# EAGLE schematic PiezoAmpBoard (EAGLE 8.0.2)
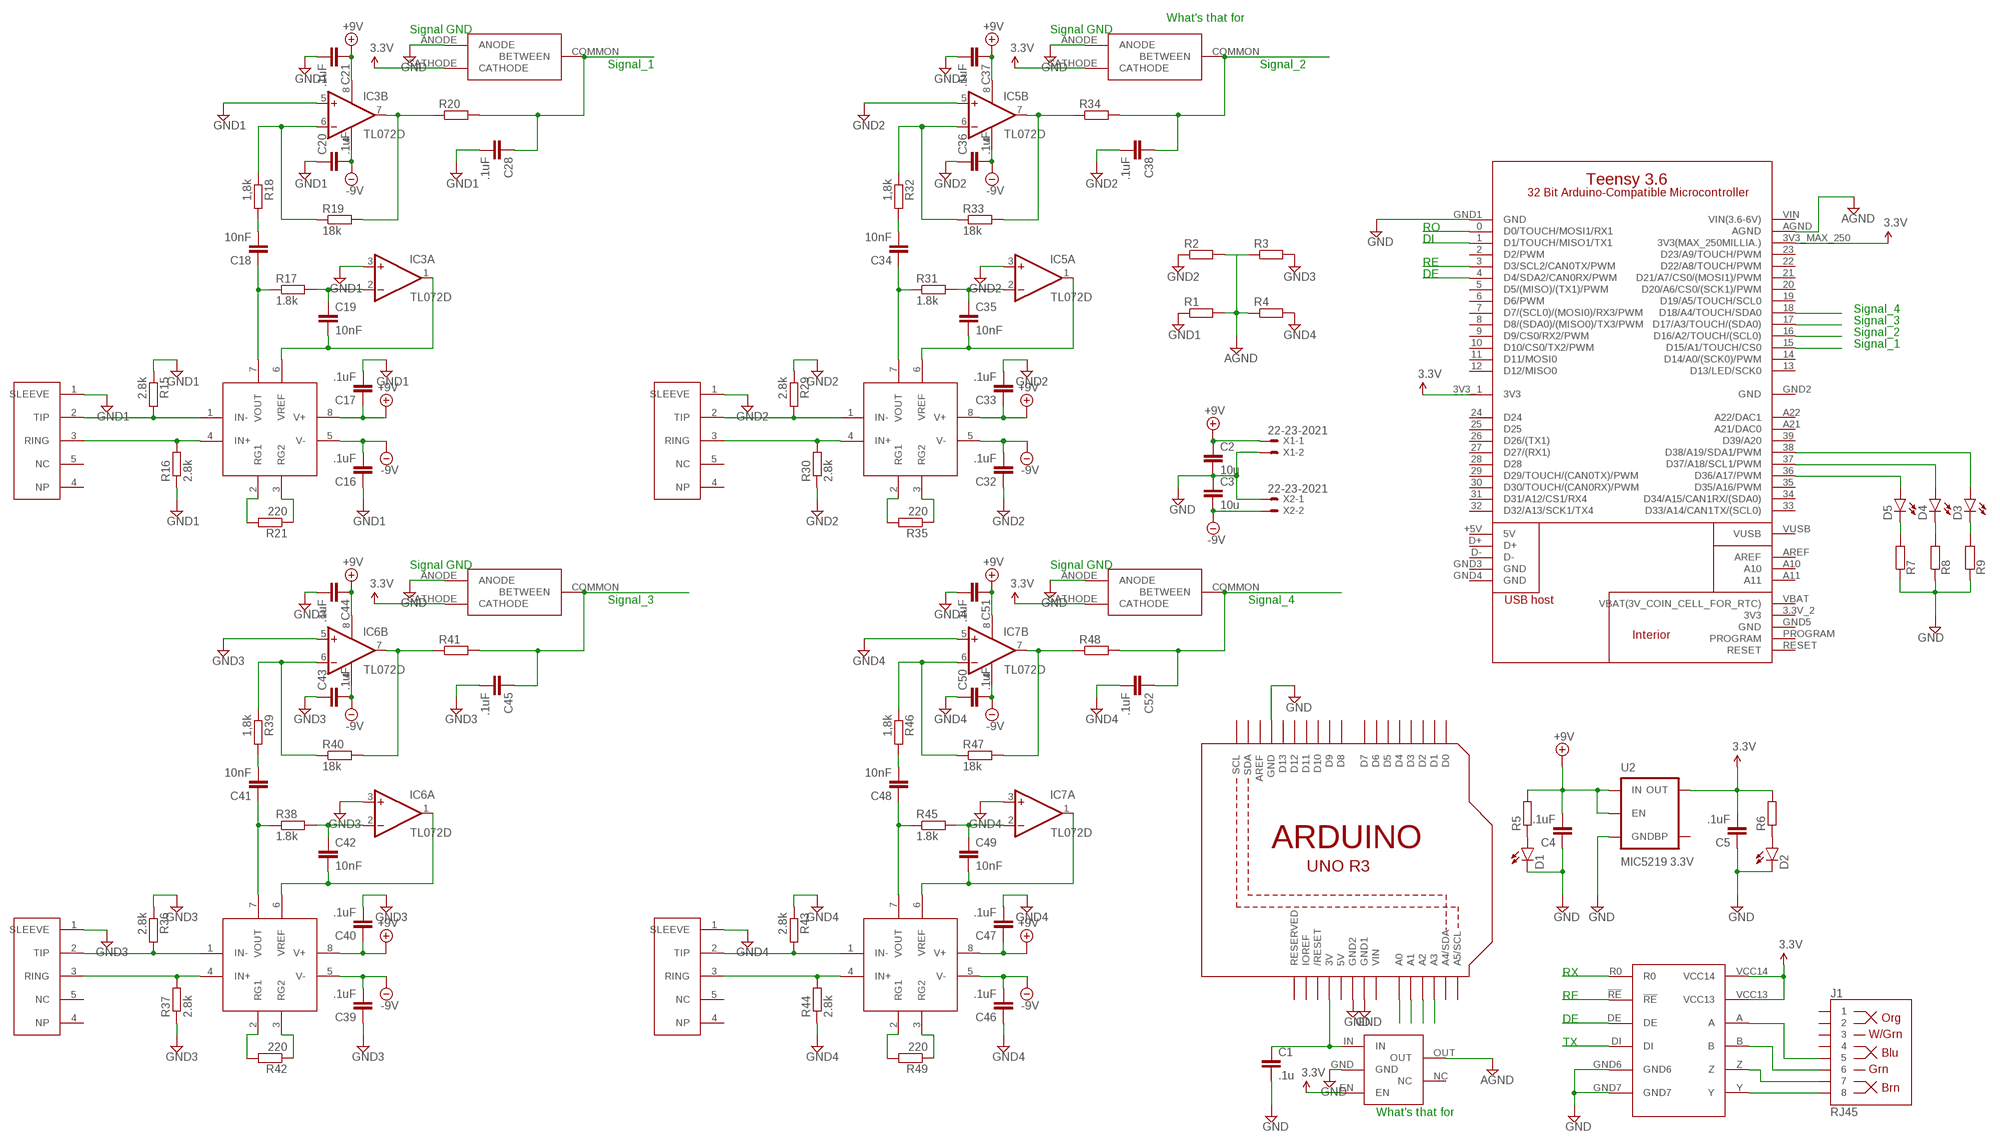
[diagram p0: schematic, sheet 1]

## Parts
C1  .1u  C-EUC0603  [C0603]
C2  10u  C-EUC0603  [C0603]
C3  10u  C-EUC0603  [C0603]
C4  .1uF  CC0603  [C0603]
C5  .1uF  CC0603  [C0603]
C16  .1uF  CC0603  [C0603]
C17  .1uF  CC0603  [C0603]
C18  10nF  CC0603  [C0603]
C19  10nF  CC0603  [C0603]
C20  .1uF  CC0603  [C0603]
C21  .1uF  CC0603  [C0603]
C28  .1uF  CC0603  [C0603]
C32  .1uF  CC0603  [C0603]
C33  .1uF  CC0603  [C0603]
C34  10nF  CC0603  [C0603]
C35  10nF  CC0603  [C0603]
C36  .1uF  CC0603  [C0603]
C37  .1uF  CC0603  [C0603]
C38  .1uF  CC0603  [C0603]
C39  .1uF  CC0603  [C0603]
C40  .1uF  CC0603  [C0603]
C41  10nF  CC0603  [C0603]
C42  10nF  CC0603  [C0603]
C43  .1uF  CC0603  [C0603]
C44  .1uF  CC0603  [C0603]
C45  .1uF  CC0603  [C0603]
C46  .1uF  CC0603  [C0603]
C47  .1uF  CC0603  [C0603]
C48  10nF  CC0603  [C0603]
C49  10nF  CC0603  [C0603]
C50  .1uF  CC0603  [C0603]
C51  .1uF  CC0603  [C0603]
C52  .1uF  CC0603  [C0603]
D1  LED0603  [LED-0603]
D2  LED0603  [LED-0603]
D3  LED0603  [LED-0603]
D4  LED0603  [LED-0603]
D5  LED0603  [LED-0603]
IC3  TL072D  [SO08]
IC5  TL072D  [SO08]
IC6  TL072D  [SO08]
IC7  TL072D  [SO08]
J1  RJ45  RJ45-8  [RJ45-8]
R1  R-EU_R0603  [R0603]
R2  R-EU_R0603  [R0603]
R3  R-EU_R0603  [R0603]
R4  R-EU_R0603  [R0603]
R5  R-EU_R0603  [R0603]
R6  R-EU_R0603  [R0603]
R7  R-EU_R0603  [R0603]
R8  R-EU_R0603  [R0603]
R9  R-EU_R0603  [R0603]
R15  2.8k  R-EU_R0603  [R0603]
R16  2.8k  R-EU_R0603  [R0603]
R17  1.8k  R-EU_R0603  [R0603]
R18  1,8k  R-EU_R0603  [R0603]
R19  18k  R-EU_R0603  [R0603]
R20  R-EU_R0603  [R0603]
R21  220  R-EU_R0603  [R0603]
R29  2.8k  R-EU_R0603  [R0603]
R30  2.8k  R-EU_R0603  [R0603]
R31  1.8k  R-EU_R0603  [R0603]
R32  1,8k  R-EU_R0603  [R0603]
R33  18k  R-EU_R0603  [R0603]
R34  R-EU_R0603  [R0603]
R35  220  R-EU_R0603  [R0603]
R36  2.8k  R-EU_R0603  [R0603]
R37  2.8k  R-EU_R0603  [R0603]
R38  1.8k  R-EU_R0603  [R0603]
R39  1,8k  R-EU_R0603  [R0603]
R40  18k  R-EU_R0603  [R0603]
R41  R-EU_R0603  [R0603]
R42  220  R-EU_R0603  [R0603]
R43  2.8k  R-EU_R0603  [R0603]
R44  2.8k  R-EU_R0603  [R0603]
R45  1.8k  R-EU_R0603  [R0603]
R46  1,8k  R-EU_R0603  [R0603]
R47  18k  R-EU_R0603  [R0603]
R48  R-EU_R0603  [R0603]
R49  220  R-EU_R0603  [R0603]
U1  ARDUINOR3-BPLACE  [ARDUINOR3-BPLACE]
U2  MIC5219 3.3V  V_REG_MIC52193.3V  [SOT23-5]
U$1  TPS76316  [PDSO]
U$2  TEENSY-3.6_ONLY_HOLES  [TEENSY-3.6_ONLY_HOLES]
U$3  MAX3491  [MAX3491]
U$4  AD82216  [SOIC08]
U$6  BAV99T  [SOT-523]
U$11  3MMJACK  [1X05]
U$14  AD82216  [SOIC08]
U$15  BAV99T  [SOT-523]
U$16  3MMJACK  [1X05]
U$17  AD82216  [SOIC08]
U$18  BAV99T  [SOT-523]
U$19  3MMJACK  [1X05]
U$20  AD82216  [SOIC08]
U$21  BAV99T  [SOT-523]
U$22  3MMJACK  [1X05]
X1  22-23-2021  [22-23-2021]
X2  22-23-2021  [22-23-2021]

## Nets
3.3V: C1.1 C5.2 R6.2 U1.3V U2.5(OUT) U$1.EN U$1.IN U$2.3V3_1(3V3) U$2.3V3_MAX_250(3V3(MAX_250MILLIA.)) U$3.VCC13 U$3.VCC14 U$6.CATHODE U$15.CATHODE U$18.CATHODE U$21.CATHODE
+9V: C4.2 R5.2 U2.1(IN) U2.3(EN)
AGND: R1.2 R2.2 R3.1 R4.1 U$1.OUT U$2.AGND
DE: U$3.DE
GND: C1.2 C2.2 C3.1 C4.1 C5.1 D1.C D2.C R7.1 R8.1 R9.1 U1.GND U1.GND1 U1.GND2 U2.2(GND) U$1.GND U$2.GND1(GND) U$3.GND6 U$3.GND7 U$6.ANODE U$15.ANODE U$18.ANODE U$21.ANODE X1.2 X2.1
GND1: C16.1 C17.2 C20.1 C21.2 C28.2 IC3.3(A:+IN) IC3.5(B:+IN) R1.1 R15.1 R16.1 U$11.1(SLEEVE)
GND2: C32.1 C33.2 C36.1 C37.2 C38.2 IC5.3(A:+IN) IC5.5(B:+IN) R2.1 R29.1 R30.1 U$16.1(SLEEVE)
GND3: C39.1 C40.2 C43.1 C44.2 C45.2 IC6.3(A:+IN) IC6.5(B:+IN) R3.2 R36.1 R37.1 U$19.1(SLEEVE)
GND4: C46.1 C47.2 C50.1 C51.2 C52.2 IC7.3(A:+IN) IC7.5(B:+IN) R4.2 R43.1 R44.1 U$22.1(SLEEVE)
N$1: D1.A R5.1
N$2: D2.A R6.1
N$3: D3.A U$2.38(D38/A19/SDA1/PWM)
N$4: D4.A U$2.37(D37/A18/SCL1/PWM)
N$5: D5.A U$2.36(D36/A17/PWM)
N$6: D3.C R9.2
N$7: D4.C R8.2
N$8: D5.C R7.2
N$9: J1.8 U$3.Y
N$10: J1.7 U$3.Z
N$11: J1.6 U$3.B
N$12: J1.5 U$3.A
N$19: R15.2 U$4.1(IN-) U$11.2(TIP)
N$20: R16.2 U$4.4(IN+) U$11.3(RING)
N$21: R21.2 U$4.2(RG1)
N$22: R21.1 U$4.3(RG2)
N$23: C18.1 R17.1 U$4.7(VOUT)
N$24: C19.1 IC3.2(A:-IN) R17.2
N$25: IC3.7(B:OUT) R19.2 R20.1
N$26: C18.2 R18.2
N$27: IC3.6(B:-IN) R18.1 R19.1
N$37: R29.2 U$14.1(IN-) U$16.2(TIP)
N$39: R30.2 U$14.4(IN+) U$16.3(RING)
N$40: R35.2 U$14.2(RG1)
N$41: R35.1 U$14.3(RG2)
N$42: C34.1 R31.1 U$14.7(VOUT)
N$43: C35.1 IC5.2(A:-IN) R31.2
N$44: IC5.7(B:OUT) R33.2 R34.1
N$45: C34.2 R32.2
N$46: IC5.6(B:-IN) R32.1 R33.1
N$47: R36.2 U$17.1(IN-) U$19.2(TIP)
N$48: R37.2 U$17.4(IN+) U$19.3(RING)
N$49: R42.2 U$17.2(RG1)
N$50: R42.1 U$17.3(RG2)
N$51: C41.1 R38.1 U$17.7(VOUT)
N$52: C42.1 IC6.2(A:-IN) R38.2
N$53: IC6.7(B:OUT) R40.2 R41.1
N$54: C41.2 R39.2
N$55: IC6.6(B:-IN) R39.1 R40.1
N$56: R43.2 U$20.1(IN-) U$22.2(TIP)
N$57: R44.2 U$20.4(IN+) U$22.3(RING)
N$58: R49.2 U$20.2(RG1)
N$59: R49.1 U$20.3(RG2)
N$60: C48.1 R45.1 U$20.7(VOUT)
N$61: C49.1 IC7.2(A:-IN) R45.2
N$62: IC7.7(B:OUT) R47.2 R48.1
N$63: C48.2 R46.2
N$64: IC7.6(B:-IN) R46.1 R47.1
PEIZOIN1: C28.1 R20.2 U1.A0 U$2.15(D15/A1/TOUCH/CS0) U$6.COMMON(BETWEEN)
PEIZOIN2: C38.1 R34.2 U1.A1 U$2.16(D16/A2/TOUCH/(SCL0)) U$15.COMMON(BETWEEN)
PEIZOIN3: C45.1 R41.2 U1.A2 U$2.17(D17/A3/TOUCH/(SDA0)) U$18.COMMON(BETWEEN)
PEIZOIN4: C52.1 R48.2 U1.A3 U$2.18(D18/A4/TOUCH/SDA0) U$21.COMMON(BETWEEN)
RE: U$2.3(D3/SCL2/CAN0TX/PWM) U$2.4(D4/SDA2/CAN0RX/PWM) U$3.!RE
RX: U$2.0(D0/TOUCH/MOSI1/RX1) U$3.R0
TX: U$2.1(D1/TOUCH/MISO1/TX1) U$3.DI
VREF2: C19.2 IC3.1(A:OUT) U$4.6(VREF)
VREF4: C35.2 IC5.1(A:OUT) U$14.6(VREF)
VREF5: C42.2 IC6.1(A:OUT) U$17.6(VREF)
VREF6: C49.2 IC7.1(A:OUT) U$20.6(VREF)
VS+1: C2.1 C17.1 C21.1 C33.1 C37.1 C40.1 C44.1 C47.1 C51.1 IC3.8(P:V+) IC5.8(P:V+) IC6.8(P:V+) IC7.8(P:V+) U$4.8(V+) U$14.8(V+) U$17.8(V+) U$20.8(V+) X1.1 ; supply symbol labelled +9V
VS-: C3.2 C16.2 C20.2 C32.2 C36.2 C39.2 C43.2 C46.2 C50.2 IC3.4(P:V-) IC5.4(P:V-) IC6.4(P:V-) IC7.4(P:V-) U$4.5(V-) U$14.5(V-) U$17.5(V-) U$20.5(V-) X2.2 ; supply symbol labelled -9V
Unconnected: J1.1 J1.2 J1.3 J1.4 U1.A4(A4/SDA) U1.A5(A5/SCL) U1.AREF U1.D0 U1.D1 U1.D2 U1.D3 U1.D4 U1.D5 U1.D6 U1.D7 U1.D8 U1.D9 U1.D10 U1.D11 U1.D12 U1.D13 U1.IOREF U1.RESERVED U1.RESET(/RESET) U1.SCL U1.SDA U2.4(BP) U$1.NC U$2.2(D2/PWM) U$2.3.3V_2(3V3) U$2.5(D5/(MISO)/(TX1)/PWM) U$2.6(D6/PWM) U$2.7(D7/(SCL0)/(MOSI0)/RX3/PWM) U$2.8(D8/(SDA0)/(MISO0)/TX3/PWM) U$2.9(D9/CS0/RX2/PWM) U$2.10(D10/CS0/TX2/PWM) U$2.11(D11/MOSI0) U$2.12(D12/MISO0) U$2.13(D13/LED/SCK0) U$2.14(D14/A0/(SCK0)/PWM) U$2.19(D19/A5/TOUCH/SCL0) U$2.20(D20/A6/CS0/(SCK1)/PWM) U$2.21(D21/A7/CS0/(MOSI1)/PWM) U$2.22(D22/A8/TOUCH/PWM) U$2.23(D23/A9/TOUCH/PWM) U$2.24(D24) U$2.25(D25) U$2.26(D26/(TX1)) U$2.27(D27/(RX1)) U$2.28(D28) U$2.29(D29/TOUCH/(CAN0TX)/PWM) U$2.30(D30/TOUCH/(CAN0RX)/PWM) U$2.31(D31/A12/CS1/RX4) U$2.32(D32/A13/SCK1/TX4) U$2.33(D33/A14/CAN1TX/(SCL0)) U$2.34(D34/A15/CAN1RX/(SDA0)) U$2.35(D35/A16/PWM) U$2.39(D39/A20) U$2.+5V(5V) U$2.A10 U$2.A11 U$2.A21(A21/DAC0) U$2.A22(A22/DAC1) U$2.AREF U$2.D+ U$2.D- U$2.GND3(GND) U$2.GND4(GND) U$2.GND5(GND) U$2.PROGRAM U$2.RESET U$2.VBAT(VBAT(3V_COIN_CELL_FOR_RTC)) U$2.VUSB U$11.4(NP) U$11.5(NC) U$16.4(NP) U$16.5(NC) U$19.4(NP) U$19.5(NC) U$22.4(NP) U$22.5(NC)

## Notes on the sheet
- What's that for
- Signal GND | Signal GND
- Signal_1 | Signal_2
- RO
- DI
- RE
- DE
- Signal_4
- Signal_3
- Signal_2
- Signal_1
- Signal GND | Signal GND
- Signal_3 | Signal_4
- RX
- RE
- DE
- TX
- What's that for

## Power pins joined to a net without a drawn wire
5V: U1.5V
GND: U$2.GND2(GND)
VIN: U1.VIN
VIN(3.6-6V): U$2.VIN(VIN(3.6-6V))

## Library data of the parts
C1-C3 = resistor:C-EU: CAPACITOR, European symbol
C4 C5 C16-C21 C28 C32-C52 = eagle-ltspice:C: CAPACITOR, European symbol; SPICEMODEL: NONE; SPICEPREFIX: C
D1-D5 = SparkFun-LED:LED: LEDs Standard schematic elements and footprints for 5mm, 3mm, 1206, and 0603 sized LEDs. 5mm - Spark Fun Electronics SKU : COM-00529 (and others)
IC3 IC5-IC7 = linear:TL072: OP AMP
J1 = SparkFun-Connectors:RJ45-8: RJ45 Jack - 8 pin Simple RJ45, 8-pin connection. Commonly used for Cat5, Cat5e, and Cat6 Ethernet cables. Here is the connector we sell at SparkFun: RJ45 8-Pin Connector <https://www.sparkfun.com/products/643> (PRT-00643) Datasheet <https://cdn.sparkfun.com/datasheets/Prototyping/04908.pdf> It is used on this SparkFun product: SparkFun RJ45 Breakout <https://www.sparkfun.com/products/716> (BOB-00716) Note, you may also be interested in the "MAGJACK" version of this. It is basically a RJ45 connector, but also has some status LEDs built into the connector housing. You can check that out in this library at the device named "MAGJACK.dev" and see these products online: RJ45 Ethernet MagJack-Compatible <https://www.sparkfun.com/products/8534> (PRT-08534) SparkFun RJ45 MagJack Breakout <https://www.sparkfun.com/products/13021> (BOB-13021); PROD_ID: CONN-08506; SF_ID: PRT-00643
R1-R9 R15-R21 R29-R49 = rcl:R-EU_: RESISTOR, European symbol
U1 = adafruit:ARDUINOR3: This is a new object for the new Arduino R3 - with extra pins that you may want to use (such as IOref, and duplicated A4/A5
U2 = SparkFun-PowerIC:V_REG_MIC5219: V_REG MIC5219 Standard 3.3V and 5V 500mA LDO voltage regulator in SOT-23 layout. Micrel part MIC5219. BP (by-pass) pin is used to lower output noise with 470pF cap, may be left open.; PROD_ID: VREG-09872
U$1 = TPS76316:TPS76316
U$2 = Teensy-3.6:TEENSY-3.6_ONLY_HOLES
U$3 = BackplaneParts:MAX3491
U$4 U$14 U$17 U$20 = AD82216:AD82216
U$6 U$15 U$18 U$21 = BAV99T:BAV99T
U$11 U$16 U$19 U$22 = 3mmJack:3MMJACK
X1 X2 = con-molex:22-23-2021: .100" (2.54mm) Center Header - 2 Pin; MF: MOLEX; MPN: 22-23-2021; OC_FARNELL: 1462926; OC_NEWARK: 25C3832